# EasyEDA Pro project adapter_rfm95w_nrf24.eprj

# Board adapter_rfm95w_nrf24
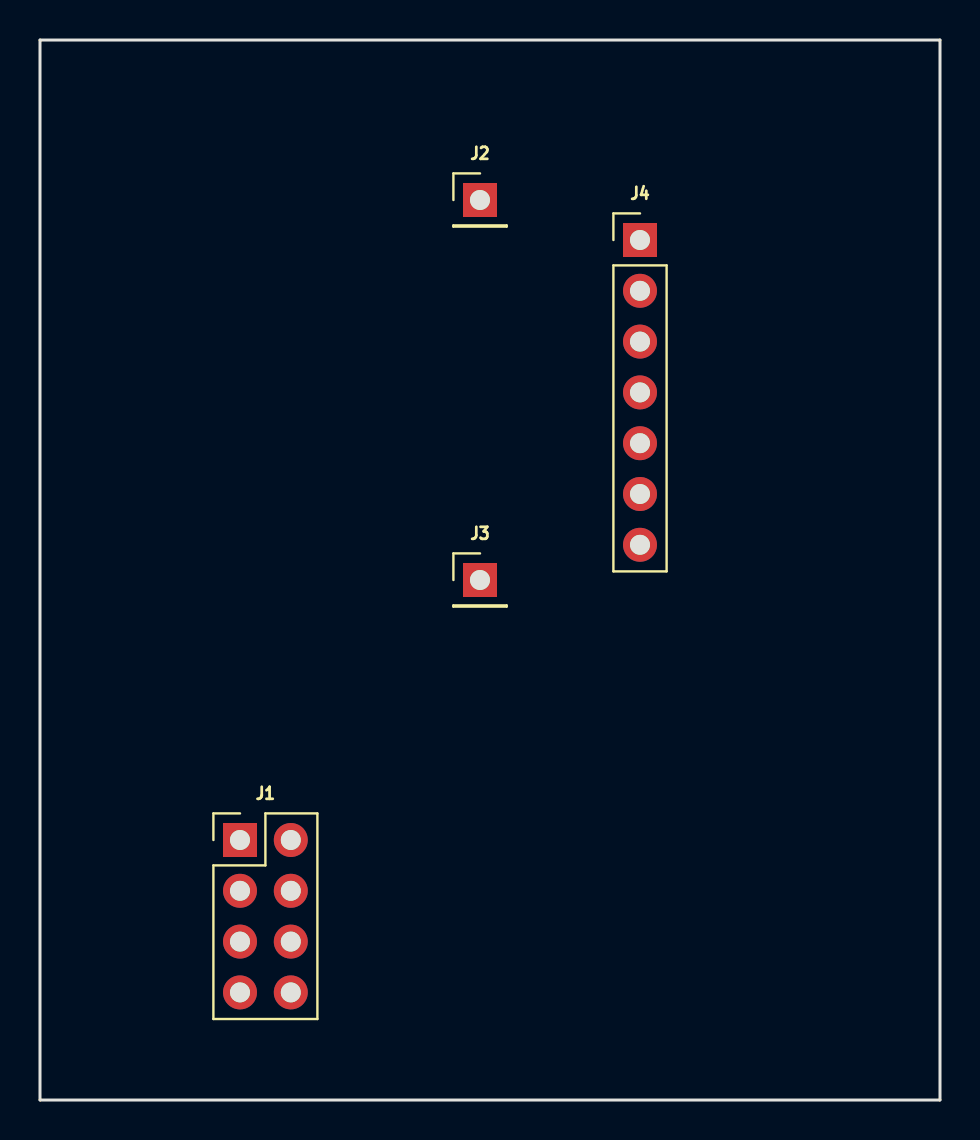
[diagram p0: board, top side]
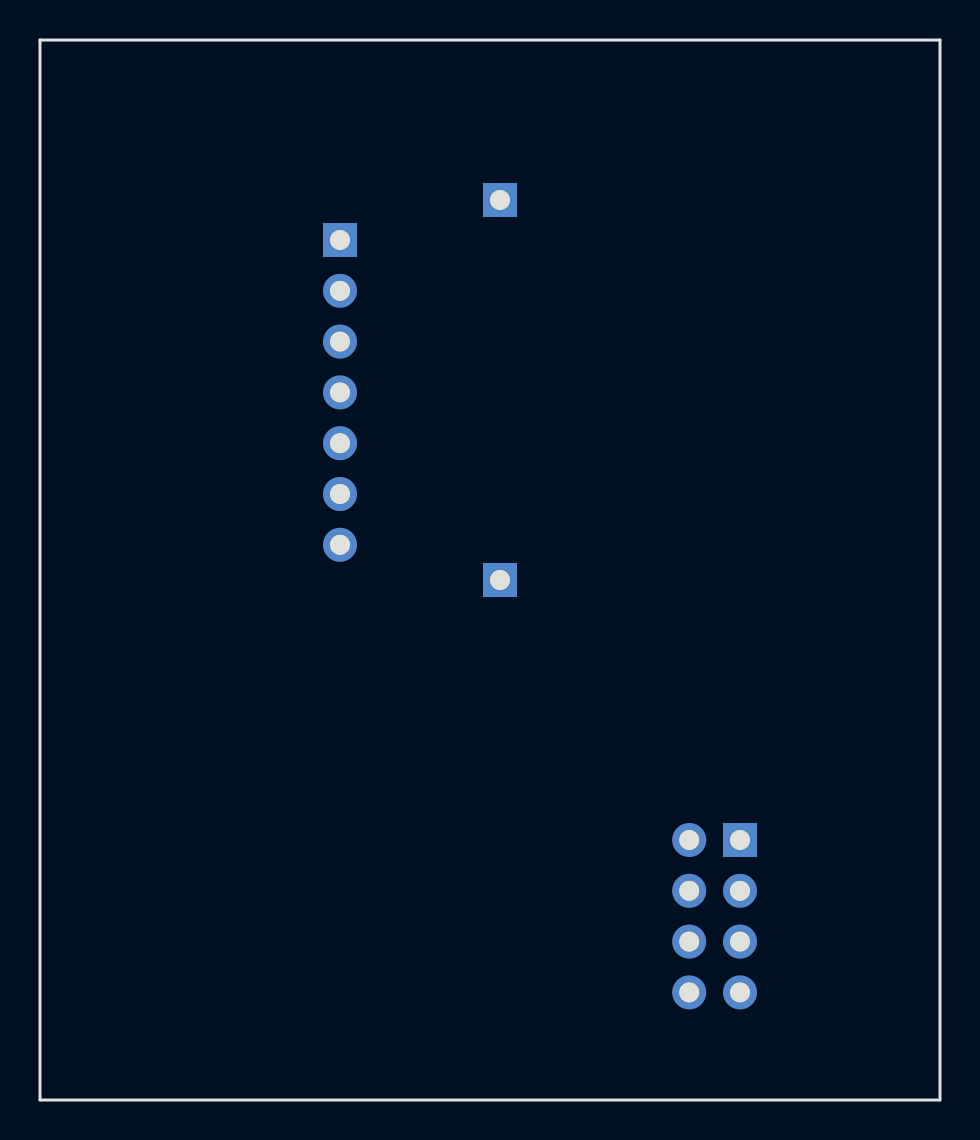
[diagram p1: board, bottom side, seen from below]

Outline 45 x 53 mm; copper layers: Top Layer, Bottom Layer. Coordinates in mm from the lower left corner of the outline.
Outline path: 0,53 45,53 45,0 0,0 0,53

## Placement (name value [footprint] x y rotation side)
J1  Conn_02x04_Odd_Even  [PinHeader_2x04_P2.54mm_Vertical]  10 13 0 top
J2  DIO0  [PinHeader_1x01_P2.54mm_Vertical]  22 45 0 top
J3  3V3  [PinHeader_1x01_P2.54mm_Vertical]  22 26 0 top
J4  Conn_01x07  [PinHeader_1x07_P2.54mm_Vertical]  30 43 0 top

## Footprints (pads in the part's own frame, mm; a bottom-side part is the same pattern mirrored in y, then rotated)
PinHeader_1x01_P2.54mm_Vertical
  rect 1.7x1.7 hole 1: 1(0,0)
PinHeader_1x07_P2.54mm_Vertical
  rect 1.7x1.7 hole 1: 1(0,0)
  round 1.7 hole 1: 2(0,-2.54) 3(0,-5.08) 4(0,-7.62) 5(0,-10.16) 6(0,-12.7) 7(0,-15.24)
PinHeader_2x04_P2.54mm_Vertical
  rect 1.7x1.7 hole 1: 1(0,0)
  round 1.7 hole 1: 2(2.54,0) 3(0,-2.54) 4(2.54,-2.54) 5(0,-5.08) 6(2.54,-5.08) 7(0,-7.62) 8(2.54,-7.62)

## Nets
GND: J1.1 J4.5 J4.7
VCC_3V3: J1.2 J3.1
IRQ_DIO0: J1.8 J2.1
SPI_CS: J1.4 J4.1
SPI_MISO: J1.7 J4.3
SPI_MOSI: J1.6 J4.2
SPI_SCK: J1.5 J4.4

Pads without a net: J1 3; J4 6
